# Altium project BuckBoost.PrjPcb
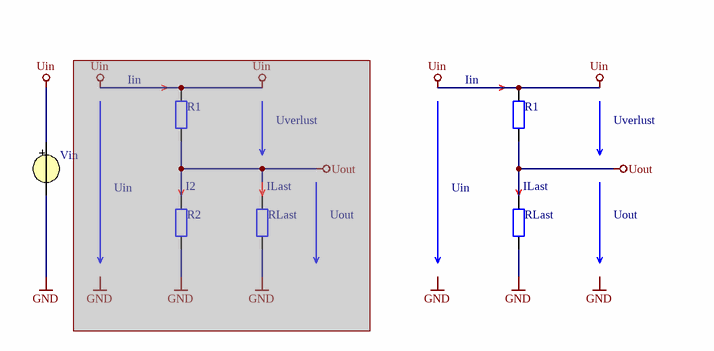
[diagram p0: Spannungsteiler.SchDoc]
2 sheets, 13 parts. Net scope: global (net labels, ports and power ports of the same name join across sheets).
Sheets:
  Spannungsteiler.SchDoc
  BuckConverter.SchDoc

## Sheet Spannungsteiler.SchDoc
size A4; DocumentNumber: 1; Revision: 0.1; SheetNumber: 1; SheetTotal: 1; HTL_Gruppe: I; HTL_Klasse: Lehrkraft; HTL_Schueler_Name: Leopold Götsch; PageSetup: Record=PageOptions|CenterHorizontal=True|CenterVertical=True|PrintScale=1.00|XCorrection=1.00|YCorrection=1.00|PrintKind=0|BorderSize=5000000|LeftOffset=0|BottomOffset=0|Orientation=2|PaperLength=1000|PaperWidth=1000|Scale=100|PaperSource=7|PrintQuality=-4|MediaType=1|DitherType=10|PaperKind=A4|PrintScaleMode=1; HTL_Projektname: Projektname; HTL_Dokumentenart: Dokumentenart; HTL_Dokumentenstatus: Entwurf

### Parts
(Parts that share a designator on the sheet are numbered #1, #2 ... from top to bottom, then left to right.)
R1#1  1K  [R_0207/RM4]  (value not drawn)  (masked out: inside a compile mask, not in the netlist)
R1#2  1K  [R_0207/RM4]  (value not drawn)
R2  1K  [R_0207/RM4]  (value not drawn)  (masked out: inside a compile mask, not in the netlist)
RLast#1  1K  [R_0207/RM4]  (value not drawn)  (masked out: inside a compile mask, not in the netlist)
RLast#2  1K  [R_0207/RM4]  (value not drawn)
Vin  DC 10V  (value not drawn)

### Nets
GND: RLast#2.2 Vin.2
Uin: R1#2.1 Vin.1
Uout: R1#2.2 RLast#2.1

### Notes on the sheet
- (near R1#1) Iin
- (near R1#2) Iin
- Uverlust
- Uin
- (near R2) I2
- (near RLast#1) ILast
- Uout
- (near RLast#2) ILast
- Labels drawn without touching a wire or pin: GND
- Sachnummer / Dateiname:
- Name:
- Gruppe:
- Klasse:
- Titel:
- Datum:
- Dokumentenart:
- Dokumentenstatus:
- Ver.:
- Blatt:
- Blätter:

### Library data of the parts
R1#1 R1#2 R2 RLast#1 RLast#2 = R: Resistor; Usage: only permitted for non-commercial purposes at HTL I Innsbruck; Published: 21-Feb-2011; LatestRevisionDate: 07-Sep-2019; Value: 1K
Vin = VSRC: Voltage Source; Value: 10V

## Sheet BuckConverter.SchDoc
size A4; DocumentNumber: 1; Revision: 0.1; SheetNumber: 2; SheetTotal: 2; HTL_Gruppe: I; HTL_Klasse: Lehrkraft; HTL_Schueler_Name: Leopold Götsch; PageSetup: Record=PageOptions|CenterHorizontal=True|CenterVertical=True|PrintScale=1.00|XCorrection=1.00|YCorrection=1.00|PrintKind=0|BorderSize=5000000|LeftOffset=0|BottomOffset=0|Orientation=2|PaperLength=1000|PaperWidth=1000|Scale=100|PaperSource=7|PrintQuality=-4|MediaType=1|DitherType=10|PaperKind=A4|PrintScaleMode=1; HTL_Projektname: Projektname; HTL_Dokumentenart: Dokumentenart; HTL_Dokumentenstatus: Entwurf; SPICEModelCacheVRKIJEEN: <root> / <DocumentId>VRKIJEEN</DocumentId> / <CacheFrame Number="0"> / <Model Name="vsw" Kind="MDL"> / <Text>*Default voltage-controlled switch / .MODEL VSW SW()</Text> / </Model> / <Model Name="di_bat42w" Kind="MDL"> / <Text>*SRC=BAT42W;DI_BAT42W;Diodes;Si;  30.0V  0.200A  5.00ns   Diodes Inc Schottky Diode / .MODEL DI_BAT42W D  ( IS=87.5u RS=18.1m BV=30.0 IBV=500n / + CJO=8.88p  M=0.333 N=3.51 TT=7.20n )</Text> / </Model> / </CacheFrame> / </root>
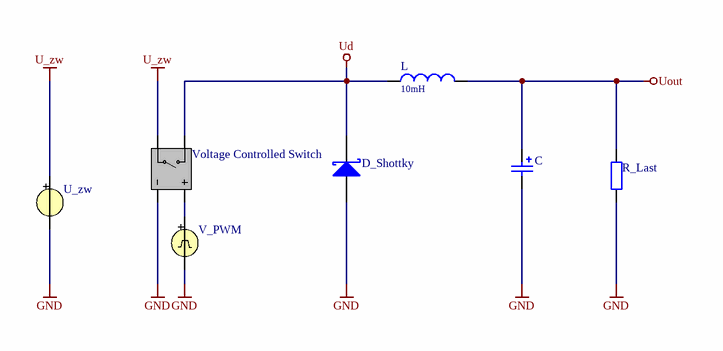
[diagram p1: BuckConverter.SchDoc]

### Parts
C  100uF  [C_POL_RM2-8,5]  (value not drawn)
D_Shottky  BAT42  [D_DO35-RM4]  (value not drawn)
L  10mH  [L_0207/RM4]
R_Last  1K  [R_0207/RM4]  (value not drawn)
U_zw  DC 10V  (value not drawn)
V_PWM  PULSE(0 5 0 1u 1u 0.5ms 1ms)  (value not drawn)
Voltage_Controlled_Switch  VSW  (value not drawn)

### Nets
GND: C.2(-) D_Shottky.A R_Last.2 U_zw.2 V_PWM.2 Voltage_Controlled_Switch.2(N1-)
U_zw: U_zw.1 Voltage_Controlled_Switch.4(N2-)
Ud: D_Shottky.C(K) L.1 Voltage_Controlled_Switch.3(N2+)
Uout: C.1(+) L.2 R_Last.1
NetV_PWM_1: V_PWM.1 Voltage_Controlled_Switch.1(N1+)

### Notes on the sheet
- Sachnummer / Dateiname:
- Name:
- Gruppe:
- Klasse:
- Titel:
- Datum:
- Dokumentenart:
- Dokumentenstatus:
- Ver.:
- Blatt:
- Blätter:

### Library data of the parts
C = C_POL: Polarized Capacitor; Usage: only permitted for non-commercial purposes at HTL I Innsbruck; Rated Voltage: 16V; Published: 21-Feb-2011; LatestRevisionDate: 07-Sep-2019; Value: 100uF
D_Shottky = BAT42: Schottky Si-Diode; 30V, 0.200A, 5.00ns (Diodes Inc); Usage: only permitted for non-commercial purposes at HTL I Innsbruck; SimulationModellSource: Diodes Incorporated; Published: 21-Feb-2011; LatestRevisionDate: 01-Nov-2012
L = L: Inductor; Usage: only permitted for non-commercial purposes at HTL I Innsbruck; Published: 21-Feb-2011; LatestRevisionDate: 07-Sep-2019; Value: 10mH
R_Last = R: as R1#1 on sheet Spannungsteiler; Published: 21-Feb-2011; LatestRevisionDate: 07-Sep-2019; Value: 1K
U_zw = VSRC: Voltage Source; Value: 10V
V_PWM = VPULSE: Pulse Voltage Source; AC Magnitude: 1; AC Phase: 0; Pulsed Value: 5; DC Magnitude: 0; Fall Time: 1u; Initial Value: 0; Period: 1ms; Pulse Width: 0.5ms; Rise Time: 1u
Voltage_Controlled_Switch = VSW: Voltage Controlled Switch; Published: 8-Jun-2000; LatestRevisionDate: 17-Jul-2002; LatestRevisionNote: Re-released for DXP Platform.; PackageReference: Not Applicable; Publisher: Altium Limited

## Nets that join several sheets
GND: Spannungsteiler (RLast#2.2 Vin.2), BuckConverter (6 pins)
Uout: Spannungsteiler (R1#2.2 RLast#2.1), BuckConverter (C.1 L.2 R_Last.1)